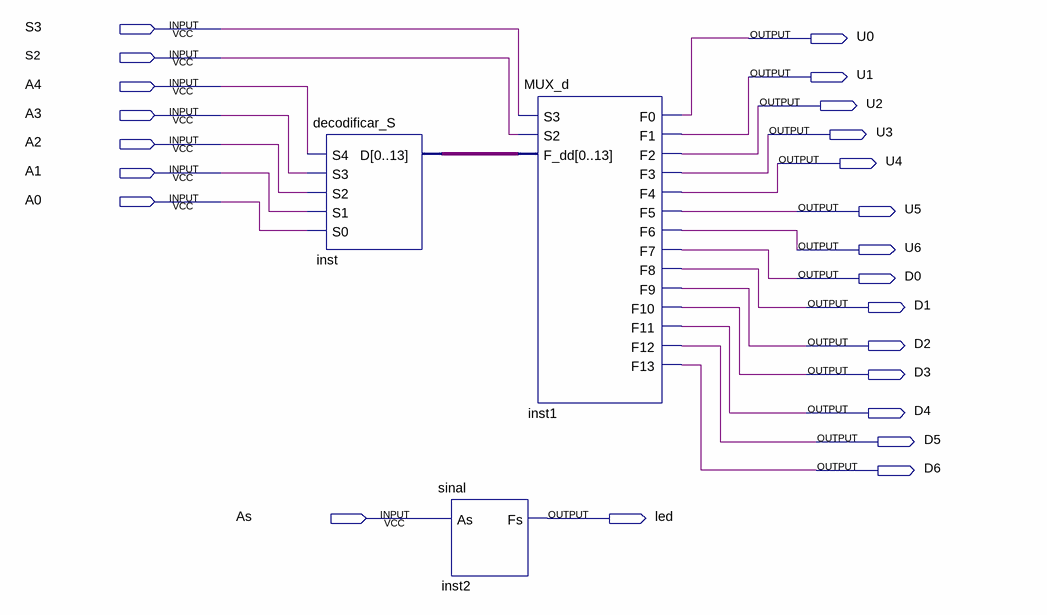
[diagram p0: schematic sheet]
// Quartus schematic deco5_final.bdf as structural Verilog: 3 symbols, 23 pins
module deco5_final (
  input  S3,
  input  S2,
  input  A4,
  input  A3,
  input  A2,
  input  A1,
  input  A0,
  input  As,
  output U0,
  output U1,
  output U2,
  output U3,
  output U4,
  output U5,
  output U6,
  output D0,
  output D1,
  output D2,
  output D3,
  output D4,
  output D5,
  output D6,
  output led
);

  wire [13:0] inst_d;

  decodificar_S inst (.S4(A4), .S3(A3), .S2(A2), .S1(A1), .S0(A0), .D(inst_d));
  sinal inst2 (.As(As), .Fs(led));
  MUX_d inst1 (
    .S3(S3), .S2(S2), .F_dd(inst_d), .F0(U0), .F1(U1), .F2(U2), .F3(U3), .F4(U4), .F5(U5), .F6(U6), .F7(D0),
    .F8(D1), .F9(D2), .F10(D3), .F11(D4), .F12(D5), .F13(D6));
endmodule
